# Altium schematic sheet PWR-RAIL.SchDoc: ANALOG SIGNAL DEV-BOARD
size A2; DrawnBy: Luca Schenetti; Revision: V1.0; SheetNumber: 2; SheetTotal: 4
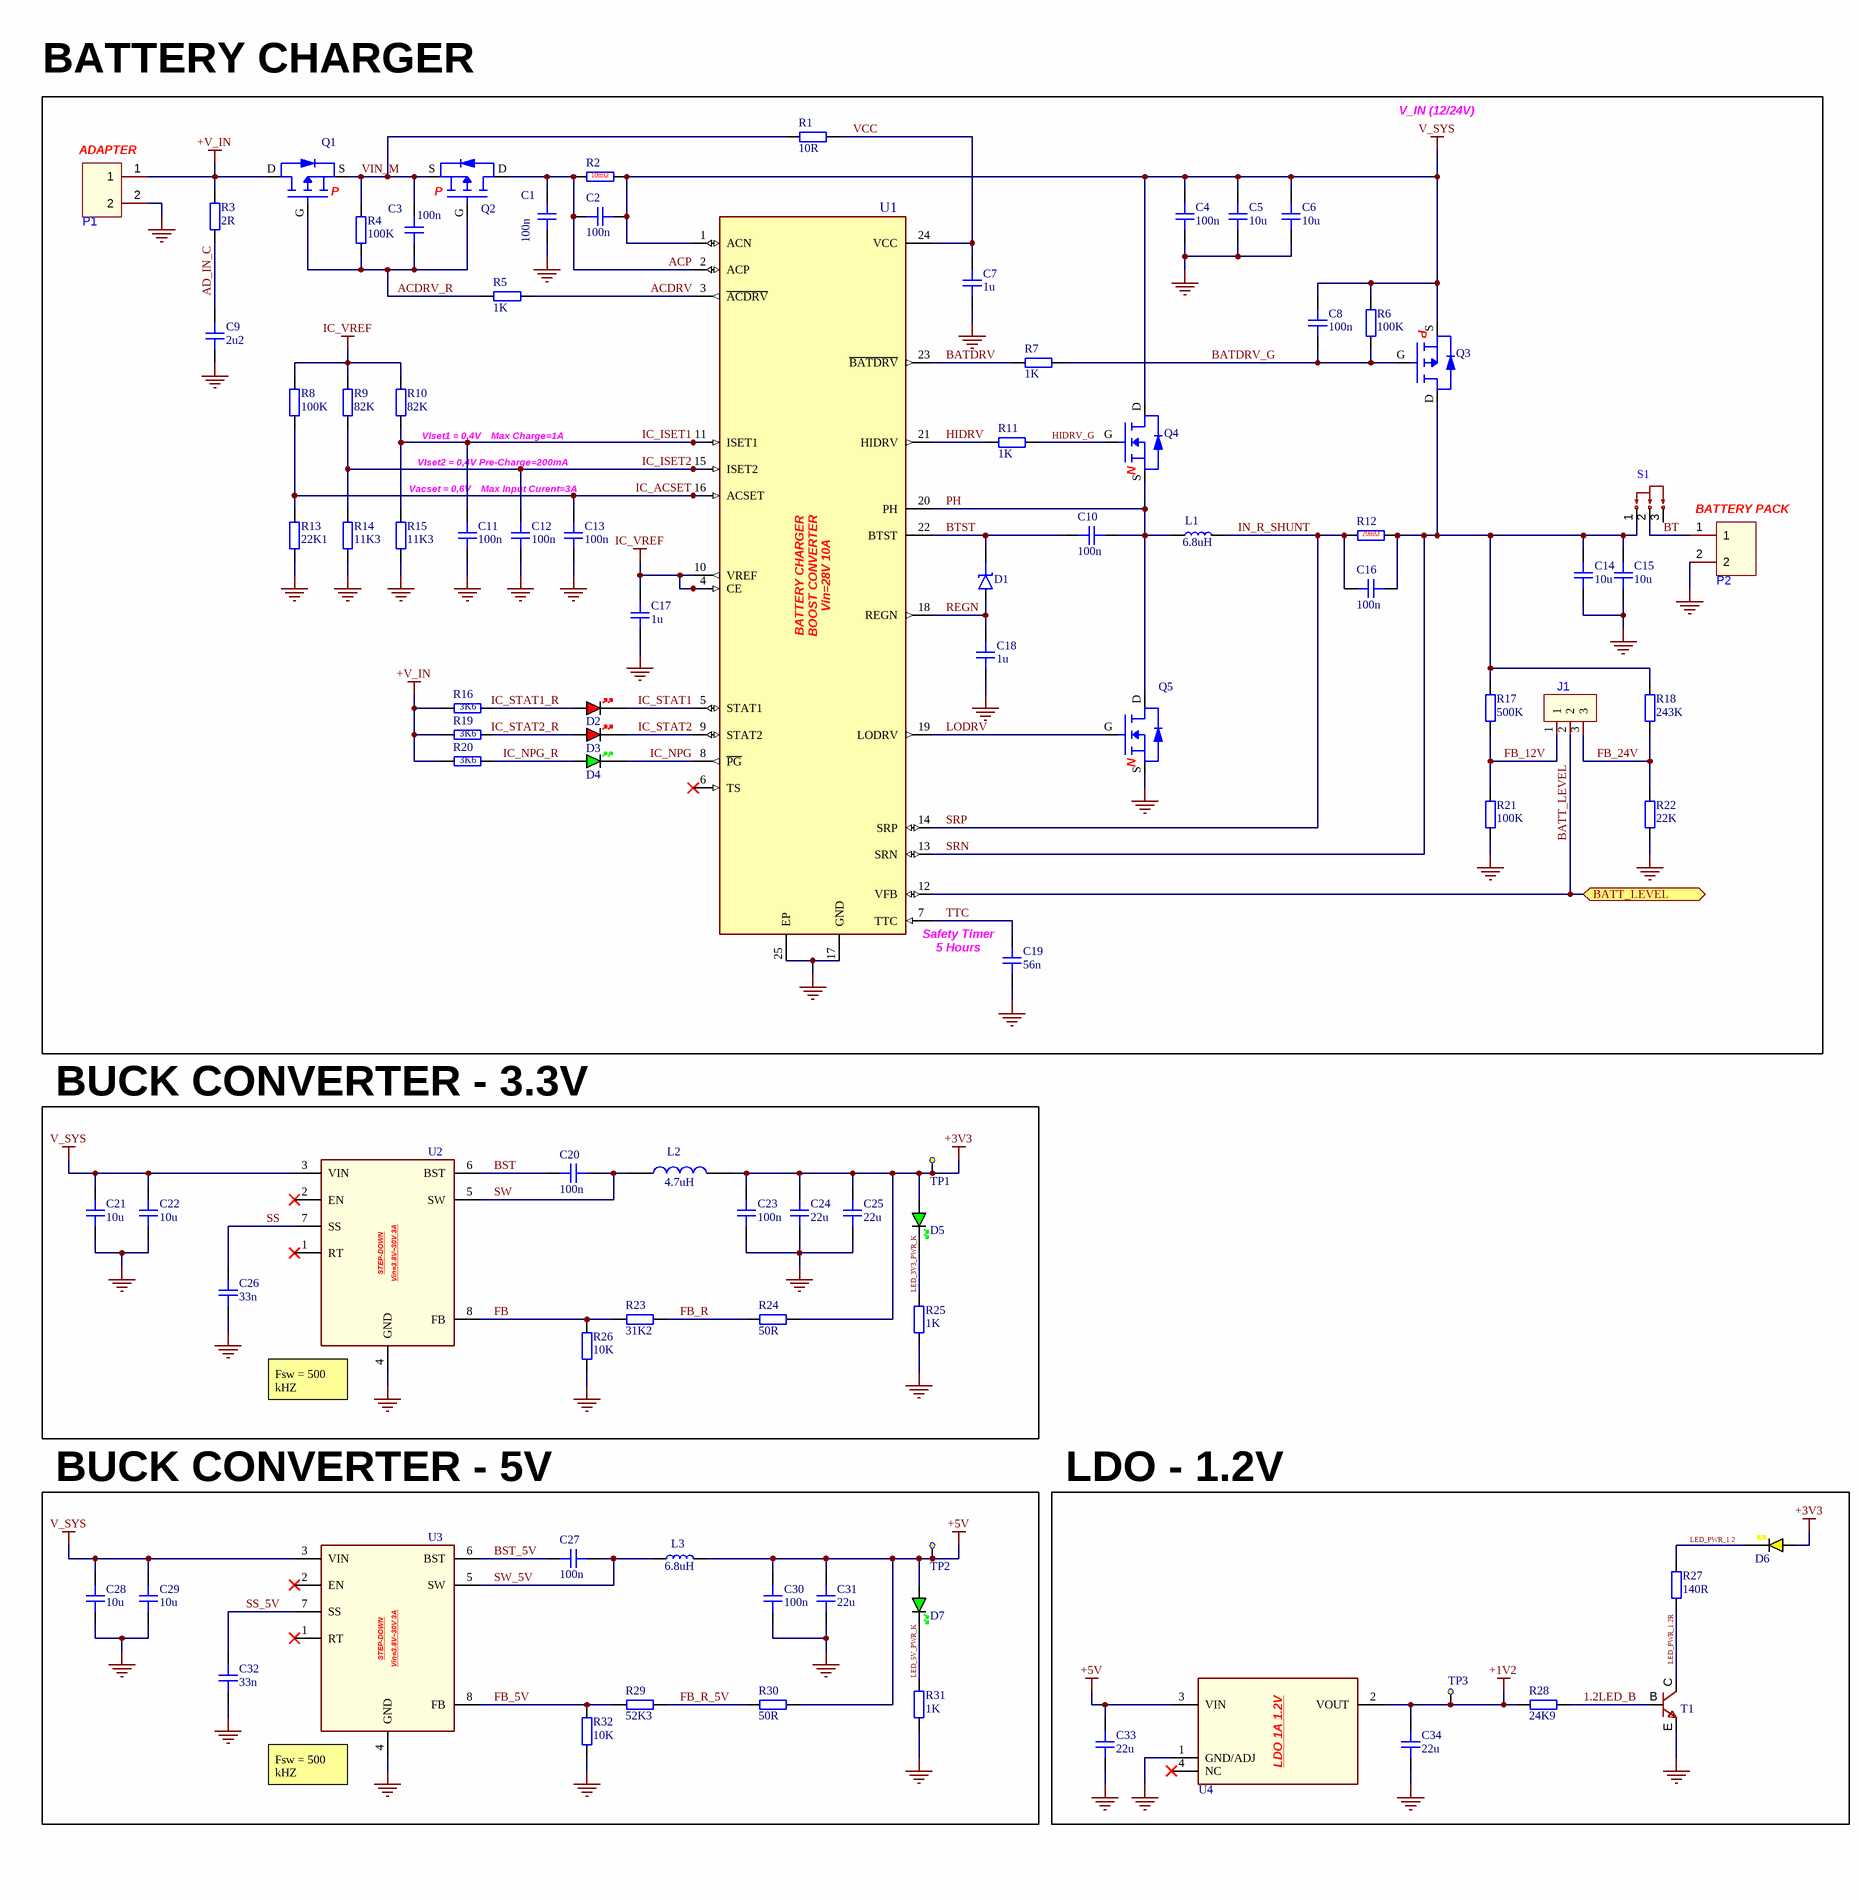
[diagram p0: PWR-RAIL.SchDoc, left]
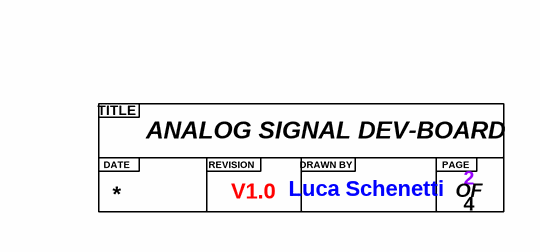
[diagram p1: PWR-RAIL.SchDoc, right]

## Parts
?  Title  (value not drawn)  (graphical)
C1  100n  [CAP_0603]
C2  100n  [CAP_0603]
C3  100n  [CAP_0603]
C4  100n  [CAP_0603]
C5  10u  [CAP_0805]
C6  10u  [CAP_0805]
C7  1u  [CAP_0603]
C8  100n  [CAP_0603]
C9  2u2  [CAP_0603]
C10  100n  [CAP_0603]
C11  100n  [CAP_0603]
C12  100n  [CAP_0603]
C13  100n  [CAP_0603]
C14  10u  [CAP_0805]
C15  10u  [CAP_0805]
C16  100n  [CAP_0603]
C17  1u  [CAP_0603]
C18  1u  [CAP_0603]
C19  56n  [CAP_0603]
C20  100n  [CAP_0603]
C21  10u  [CAP_0805]
C22  10u  [CAP_0805]
C23  100n  [CAP_0603]
C24  22u  [CAP_0603]
C25  22u  [CAP_0603]
C26  33n  [CAP_0603]
C27  100n  [CAP_0603]
C28  10u  [CAP_0805]
C29  10u  [CAP_0805]
C30  100n  [CAP_0603]
C31  22u  [CAP_0603]
C32  33n  [CAP_0603]
C33  22u  [CAP_1206]
C34  22u  [CAP_1206]
D1  Diode Schottky  [RB521S30T1G]  (value not drawn)
D2  RED  [LED_0603_RED]  (value not drawn)
D3  RED  [LED_0603_RED]  (value not drawn)
D4  GREEN  [LED_0603_GREEN]  (value not drawn)
D5  GREEN  [LED_0603_GREEN]  (value not drawn)
D6  YELLOW  [LED_0603_YELLOW]  (value not drawn)
D7  GREEN  [LED_0603_GREEN]  (value not drawn)
J1  2.54mm 3P  [2.54mm 3P]  (value not drawn)
L1  6.8uH  [FXL0530-6R8-M]
L2  4.7uH  [FXL0530-4R7-M]
L3  6.8uH  [SMMS0420-6R8M]
P1  WJ500V-5.08-2P  [CONN-TH_2P-P5.00_WJ500V-5.08-2P]  (value not drawn)
P2  WJ500V-5.08-2P  [CONN-TH_2P-P5.00_WJ500V-5.08-2P]  (value not drawn)
Q1  P-Channel VDS=-30V  [SI7617DN-T1-GE3]  (value not drawn)
Q2  P-Channel VDS=-30V  [SI7617DN-T1-GE3]  (value not drawn)
Q3  P-Channel VDS=-30V  [SI7617DN-T1-GE3]  (value not drawn)
Q4  N-Channel Vgs=30V 12A  [SIS412DN-T1-GE3]  (value not drawn)
Q5  N-Channel Vgs=30V 12A  [SIS412DN-T1-GE3]  (value not drawn)
R1  10R  [RES_1206]
R2  10mΩ  [RES_1206]
R3  2R  [RES_2010]
R4  100K  [RES_0603]
R5  1K  [RES_0603]
R6  100K  [RES_0603]
R7  1K  [RES_0603]
R8  100K  [RES_0603]
R9  82K  [RES_0603]
R10  82K  [RES_0603]
R11  1K  [RES_0603]
R12  20mΩ  [RES_1206]
R13  22K1  [RES_0603]
R14  11K3  [RES_0603]
R15  11K3  [RES_0603]
R16  3K6  [RES_0603]
R17  500K  [RES_0603]
R18  243K  [RES_0603]
R19  3K6  [RES_0603]
R20  3K6  [RES_0603]
R21  100K  [RES_0603]
R22  22K  [RES_0603]
R23  31K2  [RES_0603]
R24  50R  [RES_0603]
R25  1K  [RES_0402]
R26  10K  [RES_0603]
R27  140R  [RES_0402]
R28  24K9  [RES_0402]
R29  52K3  [RES_0603]
R30  50R  [RES_0603]
R31  1K  [RES_0402]
R32  10K  [RES_0603]
S1  3 POS SWITCH LATERAL MOUNT  [HX SS12D10G4-WJ]  (value not drawn)
T1  40V NPN IC = 1A  [MMBT3904]  (value not drawn)
TP1  Test Point  [Test Point]  (value not drawn)
TP2  Test Point  [Test Point]  (value not drawn)
TP3  Test Point  [Test Point]  (value not drawn)
U1  Battery Charger 1S-7S Buck-Boost Converter Li-Ion  [BQ24610RGER]  (value not drawn)
U2  Step Down Converter 3A 3.8V~30V  [TPS62933DRLR]  (value not drawn)
U3  Step Down Converter 3A 3.8V~30V  [TPS62933DRLR]  (value not drawn)
U4  LDO 1A 1.2V  [AMS1117-1.2]  (value not drawn)

## Blocks framed on the sheet
BATTERY CHARGER: C1-C19 D1-D4 J1 L1 P1 P2 Q1-Q5 R1-R22 S1 U1
BUCK CONVERTER - 3.3V: C20-C26 D5 L2 R23-R26 TP1 U2
BUCK CONVERTER - 5V: C27-C32 D7 L3 R29-R32 TP2 U3
LDO - 1.2V: C33 C34 D6 R27 R28 T1 TP3 U4

## Ports
BATT_LEVEL (bidir, see STM32-MCU[3C])

## Nets
+1V2: C34.2 R28.2 TP3.1(Test_Point) U4.2(VOUT)
+3V3: C23.1 C24.2 C25.2 D5.A D6.A L2.2 R24.1 TP1.1(Test_Point)
+5V: C30.1 C31.2 C33.2 D7.A L3.2 R30.1 TP2.1(Test_Point) U4.3(VIN)
+V_IN: P1.1 Q1.D R3.2 R16.1 R19.1 R20.1
GND: C1.2 C4.2 C5.1 C6.1 C7.2 C9.1 C11.1 C12.1 C13.1 C14.1 C15.1 C17.2 C18.2 C19.1 C21.1 C22.1 C23.2 C24.1 C25.1 C26.2 C28.1 C29.1 C30.2 C31.1 C32.2 C33.1 C34.1 P1.2 P2.2 Q5.S R13.1 R14.1 R15.1 R21.2 R22.2 R25.1 R26.1 R31.1 R32.1 T1.E U1.17(GND) U1.25(EP) U2.4(GND) U3.4(GND) U4.1(GND/ADJ)
IC_VREF: C17.1 R8.2 R9.2 R10.2 U1.4(CE) U1.10(VREF)
V_SYS: C2.1 C4.1 C5.2 C6.2 C8.1 C21.2 C22.2 C28.2 C29.2 Q3.S Q4.D R2.2 R6.1 U1.1(ACN) U2.3(VIN) U3.3(VIN)
1.2LED_B: R28.1 T1.B
ACDRV: R5.1 U1.3(~{ACDRV})
ACDRV_R: C3.2 Q1.G Q2.G R4.2 R5.2
ACP: C1.1 C2.2 Q2.D R2.1 U1.2(ACP)
AD_IN_C: C9.2 R3.1
BATDRV: R7.2 U1.23(~{BATDRV})
BATDRV_G: C8.2 Q3.G R6.2 R7.1
BATT_LEVEL: J1.2 U1.12(VFB) ; port BATT_LEVEL
BST: C20.2 U2.6(BST)
BST_5V: C27.2 U3.6(BST)
BT: P2.1 S1.2
BTST: C10.1 D1.K U1.22(BTST)
FB: R23.2 R26.2 U2.8(FB)
FB_5V: R29.2 R32.2 U3.8(FB)
FB_12V: J1.1 R17.2 R21.1
FB_24V: J1.3 R18.2 R22.1
FB_R: R23.1 R24.2
FB_R_5V: R29.1 R30.2
HIDRV: R11.2 U1.21(HIDRV)
HIDRV_G: Q4.G R11.1
IC_ACSET: C13.2 R8.1 R13.2 U1.16(ACSET)
IC_ISET1: C11.2 R10.1 R15.2 U1.11(ISET1)
IC_ISET2: C12.2 R9.1 R14.2 U1.15(ISET2)
IC_NPG: D4.K U1.8(~{PG})
IC_NPG_R: D4.A R20.2
IC_STAT1: D2.K U1.5(STAT1)
IC_STAT1_R: D2.A R16.2
IC_STAT2: D3.K U1.9(STAT2)
IC_STAT2_R: D3.A R19.2
IN_R_SHUNT: C16.1 L1.2 R12.1 U1.14(SRP)  [also labelled SRP]
LED_3V3_PWR_K: D5.K R25.2
LED_5V_PWR_K: D7.K R31.2
LED_PWR_1.2: D6.K R27.2
LED_PWR_1.2R: R27.1 T1.C
LODRV: Q5.G U1.19(LODRV)
PH: C10.2 L1.1 Q4.S Q5.D U1.20(PH)
REGN: C18.1 D1.A U1.18(REGN)
SRN: C14.2 C15.2 C16.2 Q3.D R12.2 R17.1 R18.1 S1.1 U1.13(SRN)
SS: C26.1 U2.7(SS)
SS_5V: C32.1 U3.7(SS)
SW: C20.1 L2.1 U2.5(SW)
SW_5V: C27.1 L3.1 U3.5(SW)
TTC: C19.2 U1.7(TTC)
VCC: C7.1 R1.2 U1.24(VCC)
VIN_M: C3.1 Q1.S Q2.S R1.1 R4.1

Not connected (* = marked no-connect by the designer): S1 3; U1 6(TS)*; U2 1(RT)* 2(EN)*; U3 1(RT)* 2(EN)*; U4 4(NC)*

## Notes on the sheet
- (near P1) ADAPTER
- V_IN (12/24V)
- (near R10) VIset1 = 0,4V    Max Charge=1A
- VIset2 = 0,4V Pre-Charge=200mA
- Vacset = 0,6V    Max Input Curent=3A
- (near P2) BATTERY PACK
- Safety Timer
- 5 Hours
- (near U2) Fsw = 500 kHZ
- (near U3) Fsw = 500 kHZ
- (in symbol BQ24610RGER) BATTERY CHARGER; BOOST CONVERTER; Vin=28V 10A
- (in symbol SI7617DN-T1-GE3) P
- (in symbol SIS412DN-T1-GE3) N
- (in symbol Title) TITLE; DATE; REVISION; DRAWN BY; PAGE; OF
- (in symbol TPS62933DRLR) STEP-DOWN; Vin=3.8V~30V 3A

## Library data of the parts
C1-C4 C8 C10-C13 C16 C20 C23 C27 C30 = CAP_0603: Capacitor SMD 0603 [C14663]; Manufacturer: *; Manufacturer Part Number: *; Distributor Link: *; LCSC: *; Rating: *; Dielectric: *
C5 C6 C14 C15 C21 C22 C28 C29 = CAP_0805: Capacitor SMD 0805[C440198]; Manufacturer: *; Manufacturer Part Number: *; Distributor Link: *; LCSC: *; Rating: *; Dielectric: *
C7 C17 C18 = CAP_0603: Capacitor SMD 0603 [C15849]; Manufacturer: *; Manufacturer Part Number: *; Distributor Link: *; LCSC: *; Rating: *; Dielectric: *
C9 = CAP_0603: [C913904]; Manufacturer: *; Manufacturer Part Number: *; Distributor Link: *; LCSC: *; Rating: *; Dielectric: *
C19 = CAP_0603: [C282072]; Manufacturer: *; Manufacturer Part Number: *; Distributor Link: *; LCSC: *; Rating: *; Dielectric: *
C24 C25 C31 = CAP_0603: Capacitor SMD 0603 [C60077]; Manufacturer: *; Manufacturer Part Number: *; Distributor Link: *; LCSC: *; Rating: *; Dielectric: *
C26 C32 = CAP_0603: [C21117]; Manufacturer: *; Manufacturer Part Number: *; Distributor Link: *; LCSC: *; Rating: *; Dielectric: *
C33 C34 = CAP_1206: [C12891]; Manufacturer: *; Manufacturer Part Number: *; Distributor Link: *; LCSC: *; Rating: *; Dielectric: *
D1 = RB521S30T1G: [C145179]
D2 D3 = LED_0603_RED: [C2926776]
D4 = LED_0603_GREEN: [C2986059]
D5 D7 = LED_0603_GREEN: LED 0603 GREEN SMD[C2986059]
D6 = LED_0603_YELLOW: LED 0603 YELLOW SMD[C72038]
J1 = 2.54mm 3P: [C6332196]; Manufacturer: HANBO(汉博); Symbol: HB-PH3-25413PB2GOP; Add into BOM: yes; Pin Structure: 1x3P; Circluar Pins/Square Pins: Square Pins; Current Rating (Max): 3A; Voltage Rating (Max): 250V; Soldering Temperature(Max): 260℃; Device: HB-PH3-25413PB2GOP; LCSC Part Name: 间距:2.54mm 1x3P 直插 方针; Supplier Part: C6332196; Manufacturer Part: HB-PH3-25413PB2GOP; Supplier Footprint: 插件,P=2.54mm; JLCPCB Part Class: Extended Part; Datasheet: https://atta.szlcsc.com/upload/public/pdf/source/20230803/F72D259687963761DF1B552F3BB84A31.pdf; Supplier: LCSC; Convert to PCB: yes; Pitch: 2.54mm; Row Spacing: 2.54mm; Mounting Type: Straight; Number of Rows: Plugin; Number of Pins: 3P; Length of Mating Pin: 6mm; Insulation Height: 2.54mm; Length of End Connection Pin: 3mm; Contact Plating: Gold; Operating Temperature Range: -40℃~+105℃; Color: Black
L1 = FXL0530-6R8-M: [C177249]
L2 = FXL0530-4R7-M: [C177246]
L3 = SMMS0420-6R8M: [C133194]
P1 P2 = WJ500V-5.08-2P: [C8465]; Manufacturer: KANGNEX(康奈克斯电气); Symbol: WJ500V-5.08-2P-14-00A; Add into BOM: yes; Structure: 1x2P; Pitch: 5.08mm; Current Rating (Max): 18A; Voltage Rating (Max): 250V; Wire Gauge - AWG: 14~30; Wire Gauge - mm2: 2.5; Number of PINs Per Row: 2; Screw Specification: M2.5; Device: WJ500V-5.08-2P; LCSC Part Name: 1x2P 5.08mm 直插 排数:1 每排P数:2; Supplier Part: C8465; Manufacturer Part: WJ500V-5.08-2P; Supplier Footprint: 插件,P=5.08mm; JLCPCB Part Class: Extended Part; Datasheet: https://atta.szlcsc.com/upload/public/pdf/source/20191225/C8465_02D34CE5B5B4A53DF5891601D97FA9F4.pdf; Supplier: LCSC; Convert to PCB: yes; Color: Green; Mounting Style: Straight; Number of Pins: 2P; Number of Rows: 1; Contact Material: -; Contact Plating: -; Operating Temperature Range: -40℃~+105℃; Soldering Temperature(Max): -
Q1-Q3 = SI7617DN-T1-GE3: [C727607]
Q4 Q5 = SIS412DN-T1-GE3: [C111309]
R1 = RES_1206: [C17903]; Manufacturer: *; Manufacturer Part Number: *; Distributor Link: *; LCSC: *
R2 = RES_1206: [C105362]; Manufacturer: *; Manufacturer Part Number: *; Distributor Link: *; LCSC: *
R3 = RES_2010: [C2960923]
R4 R6 R8 R21 = RES_0603: [C25803]; Manufacturer: *; Manufacturer Part Number: *; Distributor Link: *; LCSC: *
R5 R7 R11 = RES_0603: [C21190]; Manufacturer: *; Manufacturer Part Number: *; Distributor Link: *; LCSC: *
R9 R10 = RES_0603: [C23254]; Manufacturer: *; Manufacturer Part Number: *; Distributor Link: *; LCSC: *
R12 = RES_1206: [C7420010]; Manufacturer: *; Manufacturer Part Number: *; Distributor Link: *; LCSC: *
R13 = RES_0603: [C25961]; Manufacturer: *; Manufacturer Part Number: *; Distributor Link: *; LCSC: *
R14 R15 = RES_0603: [C22860]; Manufacturer: *; Manufacturer Part Number: *; Distributor Link: *; LCSC: *
R16 R19 R20 = RES_0603: [C22980]; Manufacturer: *; Manufacturer Part Number: *; Distributor Link: *; LCSC: *
R17 = RES_0603: [C2902631]; Manufacturer: *; Manufacturer Part Number: *; Distributor Link: *; LCSC: *
R18 = RES_0603: [C23351]; Manufacturer: *; Manufacturer Part Number: *; Distributor Link: *; LCSC: *
R22 = RES_0603: [C31850]; Manufacturer: *; Manufacturer Part Number: *; Distributor Link: *; LCSC: *
R23 = RES_0603: [C863036]; Manufacturer: *; Manufacturer Part Number: *; Distributor Link: *; LCSC: *
R24 R30 = RES_0603: [C849792]; Manufacturer: *; Manufacturer Part Number: *; Distributor Link: *; LCSC: *
R25 R31 = RES_0402: Resistor SMD 0402 [C11702]; Manufacturer: *; Manufacturer Part Number: *; Distributor Link: *; LCSC: *
R26 R32 = RES_0603: [C25804]; Manufacturer: *; Manufacturer Part Number: *; Distributor Link: *; LCSC: *
R27 = RES_0402: [C138056]; Manufacturer: *; Manufacturer Part Number: *; Distributor Link: *; LCSC: *
R28 = RES_0402: [C25874]; Manufacturer: *; Manufacturer Part Number: *; Distributor Link: *; LCSC: *
R29 = RES_0603: [C23198]; Manufacturer: *; Manufacturer Part Number: *; Distributor Link: *; LCSC: *
S1 = HX SS12D10G4-WJ: [C19189123]; Manufacturer: hanxia(韩下); Add into BOM: yes; Circuit: SPDT; Switch Length: 12.7mm; Switch Width: 6.7mm; Switch Height: 6.4mm; Current Rating (DC): 2A; Voltage Rating (DC): 125V; Mechanical Life: 3千次; Symbol: HX SS12D10G4-WJ; Device: HX SS12D10G4-WJ; LCSC Part Name: 两档卧式插件 3脚拨动开关弯插 柄长4.0mm; Supplier Part: C19189123; Manufacturer Part: HX SS12D10G4-WJ; Supplier Footprint: 插件-3P,6.7x12.7mm; JLCPCB Part Class: Extended Part; Datasheet: https://atta.szlcsc.com/upload/public/pdf/source/20231103/079DBC80FFF3B72C7ED19D92AC75D426.pdf; Supplier: LCSC; Convert to PCB: yes; Operating Temperature: -25℃~+70℃
T1 = MMBT3904: [C20526]
U1 = BQ24610RGER: [C19384]
U2 U3 = TPS62933DRLR: [C3200405]
U4 = AMS1117-1.2: [C347218]
TP1-TP3 = Test Point: Value: Test Point